# Altium schematic sheet CC1101-Module.SchDoc
size 219 x 160 mm
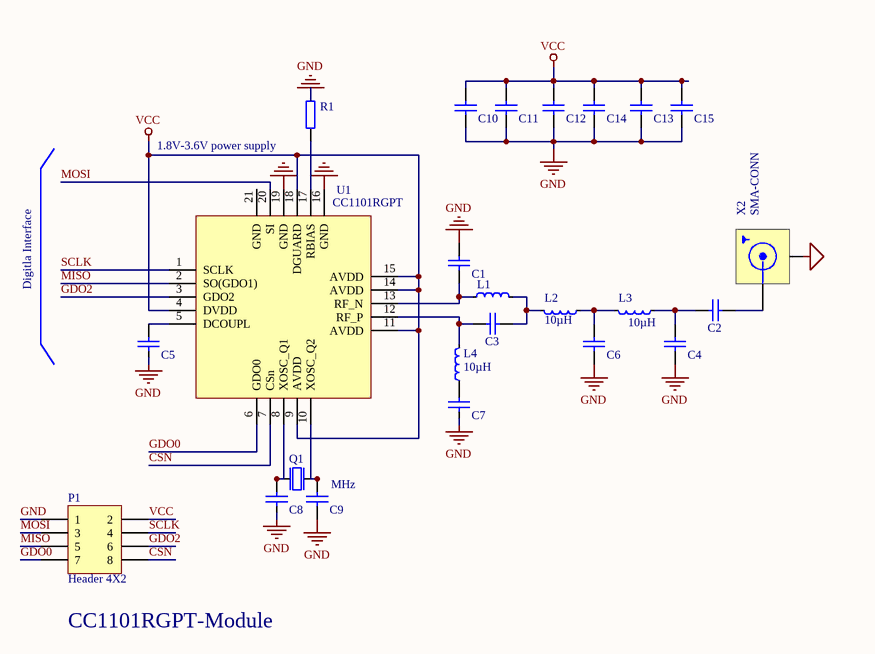
[diagram p0: CC1101-Module.SchDoc]

## Parts
C1  N.C  [C0603]  (value not drawn)
C2  N.C  [C0603]  (value not drawn)
C3  N.C  [C0603]  (value not drawn)
C4  N.C  [C0603]  (value not drawn)
C5  N.C  [C0603]  (value not drawn)
C6  N.C  [C0603]  (value not drawn)
C7  N.C  [C0603]  (value not drawn)
C8  N.C  [C0603]  (value not drawn)
C9  N.C  [C0603]  (value not drawn)
C10  N.C  [C0603]  (value not drawn)
C11  N.C  [C0603]  (value not drawn)
C12  N.C  [C0603]  (value not drawn)
C13  N.C  [C0603]  (value not drawn)
C14  N.C  [C0603]  (value not drawn)
C15  N.C  [C0603]  (value not drawn)
L1  10µH  [INDC1608X06L]  (value not drawn)
L2  10µH  [INDC1608X06L]
L3  10µH  [INDC1608X06L]
L4  10µH  [INDC1608X06L]
P1  Header 4X2  [HDR2X4]
Q1  MHz  [3225]
R1  kΩ  [R0603]  (value not drawn)
U1  CC1101RGPT  [QFN-20_L4.0-W4.0-P0.50-BL-EP2.4]
X2  SMA-CONN  [SMA_EDGELAUNCH_UFL]

## Nets
GND: C1.1 C4.1 C5.1 C6.1 C7.1 C8.1 C9.1 C10.1 C11.1 C12.1 C13.1 C14.1 C15.1 P1.1 Q1.2(GND) Q1.4(GND) R1.1 U1.16(GND) U1.19(GND) X2.GND(GND3)
VCC: C10.2 C11.2 C12.2 C13.2 C14.2 C15.2 P1.2 U1.4(DVDD) U1.9(AVDD) U1.11(AVDD) U1.14(AVDD) U1.15(AVDD) U1.18(DGUARD)
CSN: P1.8 U1.7(CSn)
GDO0: P1.7 U1.6(GDO0)
GDO2: P1.6 U1.3(GDO2)
MISO: P1.5 U1.2(SO(GDO1))
MOSI: P1.3 U1.20(SI)
SCLK: P1.4 U1.1(SCLK)
NetC1_2: C1.2 L1.1 U1.13(RF_N)
NetC2_1: C2.1 X2.F(ANT)
NetC2_2: C2.2 C4.2 L3.2
NetC3_1: C3.1 L4.2 U1.12(RF_P)
NetC3_2: C3.2 L1.2 L2.1
NetC5_2: C5.2 U1.5(DCOUPL)
NetC6_2: C6.2 L2.2 L3.1
NetC7_2: C7.2 L4.1
NetC8_2: C8.2 Q1.1(inp) U1.8(XOSC_Q1)
NetC9_2: C9.2 Q1.3(out) U1.10(XOSC_Q2)
NetR1_2: R1.2 U1.17(RBIAS)

Not connected (* = marked no-connect by the designer): U1 21(GND)

## Notes on the sheet
- (near R1) 1.8V-3.6V power supply
- Digitla Interface
- (near P1) CC1101RGPT-Module

## Library data of the parts
C1-C15 = Cap_0603: Capacitor, X5R, ±10%, 6.3V; Part Number: C0603-N.C.; Manufacturer: N.A.; Artikkelnr Noca: 20069060; Datasheet: *; LatestRevisionDate: 2009-11-23; Pin Count: 2; Publisher: Nordic Semiconductor; Published: 2009-05-08; Value: N.C; Volts: 6.3V; Supplier: *; Supplier part number: *; 2nd source Supplier: *; 2nd source part number: *; Footprint Doc: 0603; Artikkelnr Simpro: N.A.; Manufacturer Part Number: N.A.
L1-L4 = IND_0603: Inductor, 80mA, ±10%; Part Number: L0603-10µ; Manufacturer: Taiyo Yuden; Manufacturer Part Number: LBMF1608T100K; 2nd source part number: 178-6105; Note: LBMF1608T100K 10µH 80mA 0603; Artikkelnr Noca: 33029314; Artikkelnr Simpro: N.A.; Datasheet: http://www.yuden.co.jp/ut/product/pdf/elb2_e.pdf; LatestRevisionDate: 2012-09-19; Pin Count: 2; Publisher: Nordic Semiconductor; Published: 2010-02-24; Value: 10µH; Supplier: Digi-Key; Supplier part number: 587-1714-1-ND; 2nd source Supplier: Farnell; Footprint Doc: 0603
P1 = Header 4X2: Header, 4-Pin, Dual row; LatestRevisionDate: 17-Jul-2002; LatestRevisionNote: Re-released for DXP Platform.; Publisher: Altium Limited
Q1 = XTAL_3225: XTAL SMD 3226,; Part Number: XTAL_SMD2016_32MHz_8pF_Epson; Manufacturer: Epson Toyocom; Manufacturer Part Number: Q22FA12800025; Note: XTAL SMD 32.000MHz; Artikkelnr Noca: N.A.; Datasheet: http://www.epsondevice.com/docs/qd/en/DownloadServlet?id=ID000449; LatestRevisionDate: 2014-11-27; Pin Count: 4; Publisher: Nordic Semiconductor; Published: 2012-03-09; Value: MHz; Supplier: Farnell; Supplier part number: 171-2806; 2nd source Supplier: *; 2nd source part number: *; Footprint Doc: XTAL_2016; Artikkelnr Simpro: N.A.
R1 = Res_0603: Resistor, ±1%, 0.100W; Part Number: R0603-N.C.Ω; Manufacturer: N.A.; Note: Chip Res; Manufacturer Part Number: N.A.; Datasheet: *; Footprint Doc: 0603; LatestRevisionDate: 2009-05-08; Pin Count: 2; Publisher: Nordic Semiconductor; Published: 2009-05-08; Value: kΩ; Supplier: *; Supplier part number: *; 2nd source Supplier: *; 2nd source part number: *; Artikkelnr Noca: N.A.; Artikkelnr Simpro: N.A.
U1 = CC1101RGPT: 500Kbps ISM SPI QFN-20-EP(4x4) RF Transceiver ICs ROHS; Manufacturer: TI(德州仪器); Contributor: LCSC; nameAlias: Value; Supplier: LCSC; Supplier Part: C2654650; Manufacturer Part: CC1101RGPT; JLCPCB Part Class: Extended Part; spicePre: U; spiceSymbolName: CC1101RGPT
X2 = SMACONNECTOR_EDGE_UFL